# Altium schematic sheet DAC_Output_CH.SchDoc: RFSOC_SAWG
size 420 x 297 mm; Author: G.Kasprowicz; CompanyName: WUT ISE; DrawnBy: G.Kasprowicz; Organization: WUT ISE; Address1: PW ISE; Address2: Nowowiejska 15/19 00-665 Warsaw; Address3: gkasprow@gmail.com; DocumentNumber: 12; Revision: 1; SheetNumber: 12; SheetTotal: 20; ModifiedBy: -; CheckedDate: -; Title2: DAC Output; DivGrp: WUT ISE; Designer: G.Kasprowicz; ModifiedDate: -; ProjectName: Sensor Box
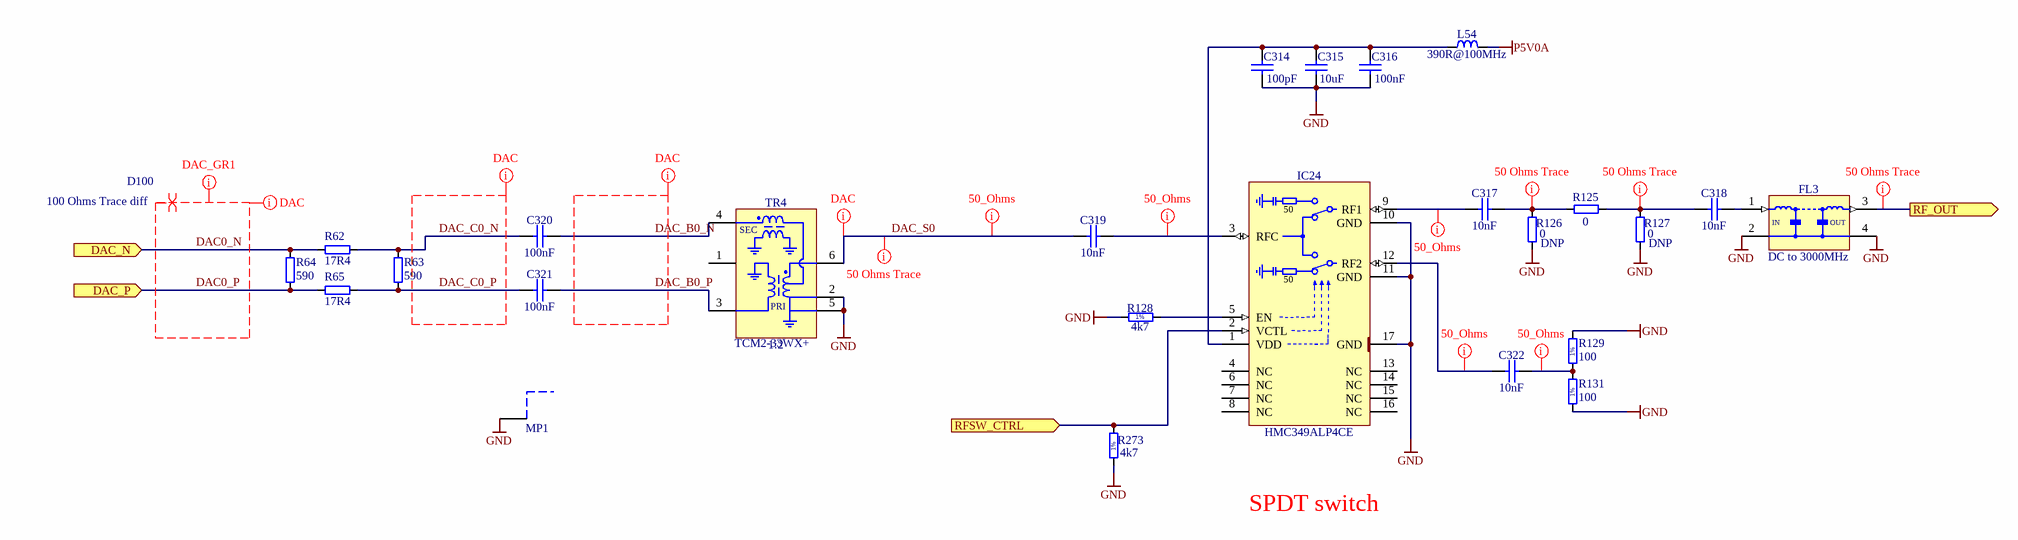
[diagram p0: DAC_Output_CH.SchDoc]

## Parts
C314  100pF  [CAPC1005X55N]
C315  10uF  [CAPC1608X80N]
C316  100nF  [CAPC1005X55N]
C317  10nF  [CAPC1005X55N]
C318  10nF  [CAPC1005X55N]
C319  10nF  [CAPC1005X55N]
C320  100nF  [CAPC0603X33N]
C321  100nF  [CAPC0603X33N]
C322  10nF  [CAPC1005X55N]
FL3  DC to 3000MHz  [FIL_MINI-CIRCUITS_FV1206]
IC24  HMC349ALP4CE  [QFN65P400X400X100-17N-S255]
L54  390R@100MHz  [INDC1608X95N]
MP1  3670230  [3670230]  (value not drawn)
R62  17R4  [RESC1005X40N]
R63  590  [RESC1005X40N]
R64  590  [RESC1005X40N]
R65  17R4  [RESC1005X40N]
R125  0  [RESC1005X40N]
R126  0  Mounted: DNP  [RESC1005X40N]
R127  0  Mounted: DNP  [RESC1005X40N]
R128  4k7  [RESC1005X40N]
R129  100  [RESC1005X40N]
R131  100  [RESC1005X40N]
R273  4k7  [RESC1005X40N]
TR4  1:2  Manufacturer Part Number: TCM2-33WX+  [XFMR_MINI-CIRCUITS_DB1627]

## Ports
DAC_N (in), DAC_P (in), RF_OUT (out), RFSW_CTRL (in)

## Nets
GND: C314.2 C315.1 C316.1 FL3.2(GND) FL3.4(GND) IC24.10(GND) IC24.11(GND) IC24.17(GND) MP1.1 R126.1 R127.1 R128.1 R129.2 R131.1 R273.1 TR4.2(P) TR4.5(GND)
P5V0A: L54.2
DAC0_N: R62.2 R64.1 ; port DAC_N
DAC0_P: R64.2 R65.2 ; port DAC_P
DAC_B0_N: C320.2 TR4.4(SD)
DAC_B0_P: C321.2 TR4.3(S)
DAC_C0_N: C320.1 R62.1 R63.1
DAC_C0_P: C321.1 R63.2 R65.1
DAC_S0: C319.1 TR4.6(P1)
RF_OUT: FL3.3(RFOUT) ; port RF_OUT
RFSW_CTRL: IC24.2(VCTL) R273.2 ; port RFSW_CTRL
NetC314_1: C314.1 C315.2 C316.2 IC24.1(VDD) L54.1
NetC317_1: C317.1 IC24.9(RF1)
NetC317_2: C317.2 R125.1 R126.2
NetC318_1: C318.1 R125.2 R127.2
NetC318_2: C318.2 FL3.1(RFIN)
NetC319_2: C319.2 IC24.3(RFC)
NetC322_1: C322.1 IC24.12(RF2)
NetC322_2: C322.2 R129.1 R131.2
NetIC24_5: IC24.5(EN) R128.2

Not connected (* = marked no-connect by the designer): IC24 4(NC) 6(NC) 7(NC) 8(NC) 13(NC) 14(NC) 15(NC) 16(NC); TR4 1(NC)

## Layout directives
net class DAC_GR1: DAC0_N, DAC0_P
differential pair; differential pair class 100 Ohms Trace diff; net class D100: DAC0_N, DAC0_P
net class 50 Ohms Trace: DAC_S0, NetC317_2, NetC318_1, RF_OUT
net class DAC: DAC0_N, DAC0_P, DAC_B0_N, DAC_B0_P, DAC_C0_N, DAC_C0_P, DAC_S0
net class 50_Ohms: DAC_S0, NetC317_1, NetC319_2, NetC322_1, NetC322_2

## Notes on the sheet
- SPDT switch
- Project/Equipment
- Document
- Designer
- Drawn by
- Check.by
- Copyright WUT ISE 2020.
  This documentation describes Open Hardware and is licensed under the CERN OHL v.1.2. You may redistribute and modify this documentation under the terms of the CERN OHL v.1.2. (http://ohwr.org/CERNOHL). This documentation is distributed WITHOUT ANY EXPRESS OR IMPLIED WARRANTY, INCLUDING OF MERCHANTABILITY, SATISFACTORY QUALITY AND FITNESS FOR A PARTICULAR PURPOSE. Please see the CERN OHL v.1.2 for applicable conditions.
- Contact
- File
- Last Mod.
- Print Date
- Sheet
- Size
- A3
- of
- Rev
- (in symbol FIL_MINI-CIRCUITS_LFCN-3000+) IN; OUT
- (in symbol HMC349ALP4CE) 50
- (in symbol R0402_4K7_1%_0.0625W_100PPM) 1%
- (in symbol R0402_100R_1%_0.1W_100PPM) 1%
- (in symbol XFMR_MINI-CIRCUITS_TCM2-33WX+) SEC; PRI

## Library data of the parts
C314 = CC0402_100PF_50V_5%_C0G: Non-polarised capacitor; Part Description: SMD Multilayer Chip Ceramic Capacitor; Manufacturer: GENERIC; Manufacturer1 Part Number: C0402C101J5GACTU; Voltage: 50V; TC: C0G/NP0; Tolerance: ±5%; Part Number: CC0402_100PF_50V_5%_C0G; Component Kind: Standard; Component Type: Standard; Pin Count: 2; Value: 100pF; Status: Preferred; Manufacturer Part Number: CC0402_100PF_50V_5%_C0G; Case: 0402; Mounted: Yes; Socket: No; SMD: Yes; Sense: No; Manufacturer1 Example: KEMET; Manufacturer1 ComponentHeight: 0.55mm; HelpURL: \\cern.ch\dfs\Applications\Altium\Datasheets\CC0805_C0G_KEMET_(Commercial Grade).pdf; Author: CERN DEM JLC; CreateDate: 2007-12-03; LatestRevisionDate: 2015-04-22
C315 = CC0603_10UF_16V_20%_X5R: Non-polarised capacitor; Part Description: SMD Multilayer Chip Ceramic Capacitor; Manufacturer: GENERIC; Manufacturer1 Part Number: GRM188R61C106MA73D; Voltage: 16V; TC: X5R; Tolerance: ±20%; Part Number: CC0603_10UF_16V_20%_X5R; Component Kind: Standard; Component Type: Standard; Pin Count: 2; Value: 10uF; Status: None; Manufacturer Part Number: CC0603_10UF_16V_20%_X5R; Case: 0603; Mounted: Yes; Socket: No; SMD: Yes; Sense: No; Manufacturer1 Example: MURATA; Manufacturer1 ComponentHeight: 0.8mm; HelpURL: \\cern.ch\dfs\Applications\Altium\Datasheets\CC0603_X5R_MURATA_GRM.pdf; Author: CERN DEM MR; CreateDate: 2016-03-02; LatestRevisionDate: 2016-03-02
C316 = CC0402_100NF_16V_10%_X7R: Non-polarised capacitor; Part Description: SMD Multilayer Chip Ceramic Capacitor; Manufacturer: GENERIC; Manufacturer1 Part Number: GRM155R71C104KA88D; Voltage: 16V; TC: X7R; Tolerance: ±10%; Part Number: CC0402_100NF_16V_10%_X7R; Component Kind: Standard; Component Type: Standard; Pin Count: 2; Value: 100nF; Status: Not Recommended; Manufacturer Part Number: CC0402_100NF_16V_10%_X7R; Case: 0402; Mounted: Yes; Socket: No; SMD: Yes; Sense: No; Manufacturer1 Example: MURATA; Manufacturer1 ComponentHeight: 0.55mm; HelpURL: \\cern.ch\dfs\Applications\Altium\Datasheets\CC0402_X7R_MURATA_GRM.pdf; Author: CERN DEM JLC; CreateDate: 2013-12-05; LatestRevisionDate: 2007-12-03
C317-C319 C322 = CC0402_10NF_16V_10%_X7R: Non-polarised capacitor; Part Description: SMD Multilayer Chip Ceramic Capacitor; Manufacturer: GENERIC; Manufacturer1 Part Number: 223878715636; Voltage: 16V; TC: X7R; Tolerance: ±10%; Part Number: CC0402_10NF_16V_10%_X7R; Component Kind: Standard; Component Type: Standard; Pin Count: 2; Value: 10nF; Status: Not Recommended; Manufacturer Part Number: CC0402_10NF_16V_10%_X7R; Case: 0402; Mounted: Yes; Socket: No; SMD: Yes; Sense: No; Manufacturer1 Example: PHYCOMP; Manufacturer1 ComponentHeight: 0.55mm; HelpURL: \\cern.ch\dfs\Applications\Altium\Datasheets\CC0402_X7R_PHYCOMP.pdf; Author: CERN DEM JLC; CreateDate: 2007-12-03; LatestRevisionDate: 2007-12-03
C320 C321 = CC0201_100NF_6.3V_10%_X5R: Non-polarised capacitor; Part Description: SMD Multilayer Chip Ceramic Capacitor; Manufacturer: GENERIC; Manufacturer1 Part Number: 02016D104KAT2A; Voltage: 6.3V; TC: X5R; Tolerance: ±10%; Part Number: CC0201_100NF_6.3V_10%_X5R; Component Kind: Standard; Component Type: Standard; Pin Count: 2; Value: 100nF; Status: Not Recommended; Manufacturer Part Number: CC0201_100NF_6.3V_10%_X5R; Case: 0201; Mounted: Yes; Socket: No; SMD: Yes; Sense: No; Manufacturer1 Example: AVX; Manufacturer1 ComponentHeight: 0.33mm; HelpURL: \\cern.ch\dfs\Applications\Altium\Datasheets\CC0201_X5R_AVX.pdf; Author: CERN DEM JLC; CreateDate: 03.12.2007; LatestRevisionDate: 03.12.2007
FL3 = FIL_MINI-CIRCUITS_LFCN-3000+: 50 Ohm Low Pass Filter; Part Number: FIL_MINI-CIRCUITS_LFCN-3000+; Component Kind: Standard; Component Type: Standard; Pin Count: 4; Value: DC to 3000MHz; Part Description: 50 Ohm Low Pass Filter; Manufacturer: MINI-CIRCUITS; Manufacturer Part Number: LFCN-3000+; Mounted: Yes; Socket: No; SMD: Yes; Sense: No; ComponentHeight: 0.94mm; HelpURL: \\cern.ch\dfs\Applications\Altium\Datasheets\FIL_MINI-CIRCUITS_LFCN-3000+.pdf; Author: CERN DEM JLC; CreateDate: 09.12.2013; LatestRevisionDate: 09.12.2013
IC24 = HMC349ALP4CE: DC-4GHz High Isolation SPDT Non-Reflective Switch; Manufacturer: ANALOG DEVICES; PressFit: No; Bonding: No; Part Number: HMC349ALP4CE; Component Kind: Standard; Component Type: Standard; Device: HMC349ALP4CE; PackageDescription: QFN, 0.65mm pitch,square; 4 pin X 4 pin, 4mm X 4mm X 1mm H body (w/thermal tab 2.55 X 2.55mm),  IPC Medium Density; Part Description: DC-4GHz High Isolation SPDT Non-Reflective Switch; Manufacturer Part Number: HMC349ALP4CE; Pin Count: 17; Case: QFN16; Mounted: Yes; Socket: No; SMD: Yes; Sense: No; ComponentHeight: 1mm; Author: CERN DEM JLC; HelpURL: \\cern.ch\dfs\Applications\Altium\Datasheets\HMC349ALP4CE.pdf; CreateDate: 2017-02-23; LatestRevisionDate: 2017-02-23
L54 = IND0603_TDK_MPZ1608R391A: Inductor; Part Description: SMT Chip Bead for Power Line; Manufacturer: TDK; Power: 1.2A; Resistance: 0.12R; Tolerance: ±25%; Part Number: IND0603_TDK_MPZ1608R391A; Component Kind: Standard; Component Type: Standard; Pin Count: 2; Value: 390R@100MHz; Status: None; Manufacturer Part Number: MPZ1608R391A; Case: 0603; Mounted: Yes; Socket: No; SMD: Yes; Sense: No; ComponentHeight: 0.95mm; HelpURL: \\cern.ch\dfs\Applications\Altium\Datasheets\IND0603_TDK_MPZ1608.pdf; Author: CERN DEM JLC; CreateDate: 2009-12-02; LatestRevisionDate: 2009-12-02
MP1 = 3670230: WE-SHC Shielding Cabinet, SMT Frame Seamless, Tin Plated, Tray, 23x11.7x5mm; Manufacturer: Wurth Elektronik; Base Material: Steel; ComponentLink1Description: Website Link; ComponentLink1URL: https://www.we-online.com/redexpert/article/3670230?ad; ComponentLink2Description: Datasheet Link; ComponentLink2URL: https://www.we-online.com/redexpert/spec/3670230?ad; Manufacturer Part Number: 3670230; Category: EMC Shielding; Match Code: WE-SHC; Mount: Surface Mount; Operating Temperature Max: 125°C; Operating Temperature Min: -40°C; Packaging: Tray; Length: 23mm; Width: 11.7mm; Height: 5mm; Plating: Tin Plated; Type: SMT Frame Seamless
R62 R65 = R0402_17R4_1%_0.1W_100PPM: Resistor - 1%; Part Description: General Purpose Thick Film Chip Resistor; Manufacturer: GENERIC; Manufacturer1 Part Number: ERJ2RKF17R4X; Voltage: 50V; Power: 0.1W; TC: ±100ppm/°C; PressFit: No; Case: 0402; Value: 17R4; Tolerance: ±1%; Part Number: R0402_17R4_1%_0.1W_100PPM; Component Kind: Standard; Component Type: Standard; Pin Count: 2; Status: Not Recommended; Manufacturer Part Number: R0402_17R4_1%_0.1W_100PPM; Mounted: Yes; Sense: No; Socket: No; SMD: Yes; Manufacturer1 Example: PANASONIC; Manufacturer1 ComponentHeight: 0.4mm; HelpURL: \\cern.ch\dfs\Applications\Altium\Datasheets\R0402_PANASONIC_ERJ2RK.pdf; Author: CERN DEM BC; CreateDate: 19.04.2021; LatestRevisionDate: 19.04.2021
R63 R64 = R0402_590R_1%_0.1W_100PPM: Resistor - 1%; Part Description: General Purpose Thick Film Chip Resistor; Manufacturer: GENERIC; Manufacturer1 Part Number: ERJ2RKF5900X; Voltage: 50V; Power: 0.1W; TC: ±100ppm/°C; PressFit: No; Case: 0402; Value: 590; Tolerance: ±1%; Part Number: R0402_590R_1%_0.1W_100PPM; Component Kind: Standard; Component Type: Standard; Pin Count: 2; Status: Not Recommended; Manufacturer Part Number: R0402_590R_1%_0.1W_100PPM; Mounted: Yes; Sense: No; Socket: No; SMD: Yes; Manufacturer1 Example: PANASONIC; Manufacturer1 ComponentHeight: 0.4mm; HelpURL: \\cern.ch\dfs\Applications\Altium\Datasheets\R0402_PANASONIC_ERJ2RK.pdf; Author: CERN DEM BC; CreateDate: 19.04.2021; LatestRevisionDate: 19.04.2021
R125-R127 = R0402_0R_JUMPER: Resistor; Part Description: 1A (0.05R Max DC Resistance) Zero Ohm Jumper; Manufacturer: GENERIC; Manufacturer1 Part Number: 232270591001L; Part Number: R0402_0R_JUMPER; Component Kind: Standard; Component Type: Standard; Pin Count: 2; Value: 0; Status: Not recommended; Manufacturer Part Number: R0402_0R_JUMPER; Case: 0402; Sense: No; Socket: No; SMD: Yes; Manufacturer1 Example: YAGEO PHYCOMP; Manufacturer1 ComponentHeight: 0.4mm; HelpURL: \\cern.ch\dfs\Applications\Altium\Datasheets\R0402_Phycomp_RC0402.pdf; Author: CERN DEM JLC; CreateDate: 2007-12-03; LatestRevisionDate: 2012-10-17
  R125: Mounted: Yes
R128 R273 = R0402_4K7_1%_0.0625W_100PPM: Resistor - 1%; Part Description: General Purpose Thick Film Chip Resistor; Manufacturer: GENERIC; Manufacturer1 Part Number: 232270674702L; TC: ±100ppm/°C; Part Number: R0402_4K7_1%_0.0625W_100PPM; Component Kind: Standard; Component Type: Standard; Pin Count: 2; Value: 4k7; Status: Not recommended; Power: 0.0625W; Tolerance: ±1%; Manufacturer Part Number: R0402_4K7_1%_0.0625W_100PPM; Case: 0402; Mounted: Yes; Sense: No; Socket: No; SMD: Yes; Manufacturer1 Example: YAGEO PHYCOMP; Manufacturer1 ComponentHeight: 0.4mm; HelpURL: \\cern.ch\dfs\Applications\Altium\Datasheets\R0402_Phycomp_RC0402.pdf; Author: CERN DEM JLC; CreateDate: 2007-12-03; LatestRevisionDate: 2012-10-17
R129 R131 = R0402_100R_1%_0.1W_100PPM: Resistor - 1%; Part Description: General Purpose Thick Film Chip Resistor; Manufacturer: GENERIC; Manufacturer Part Number: R0402_100R_1%_0.1W_100PPM_50V; Manufacturer1 Part Number: ERJ2RKF1000X; Power: 0.1W; TC: ±100ppm/°C; Voltage: 50V; Part Number: R0402_100R_1%_0.1W_100PPM; Component Kind: Standard; Component Type: Standard; Pin Count: 2; Value: 100; Status: Not recommended; Tolerance: ±1%; Case: 0402; Mounted: Yes; Sense: No; Socket: No; SMD: Yes; Manufacturer1 Example: PANASONIC; Manufacturer1 ComponentHeight: 0.4mm; HelpURL: \\cern.ch\dfs\Applications\Altium\Datasheets\R0402_PANASONIC_ERJ2RK.pdf; Author: CERN DEM JLC; CreateDate: 12.12.2013; LatestRevisionDate: 03.03.2015
TR4 = XFMR_MINI-CIRCUITS_TCM2-33WX+: 50 OHMS 10 to 3000 MHz RF Transformer; Power: 0.4W; Part Number: XFMR_MINI-CIRCUITS_TCM2-33WX+; Component Kind: Standard; Component Type: Standard; Pin Count: 6; Value: 1:2; Status: None; Part Description: 50 Ohms 10 to 3000MHz RF Transformer; Manufacturer: MINI-CIRCUITS; Mounted: Yes; Socket: No; Sense: No; SMD: Yes; ComponentHeight: 4.06mm; HelpURL: \\cern.ch\dfs\Applications\Altium\Datasheets\XFMR_MINI-CIRCUITS_TCM2-33WX+.pdf; Author: CERN DEM MR; CreateDate: 01.12.2016; LatestRevisionDate: 01.12.2016